# EAGLE design PiezoAmp (EAGLE 5.11)
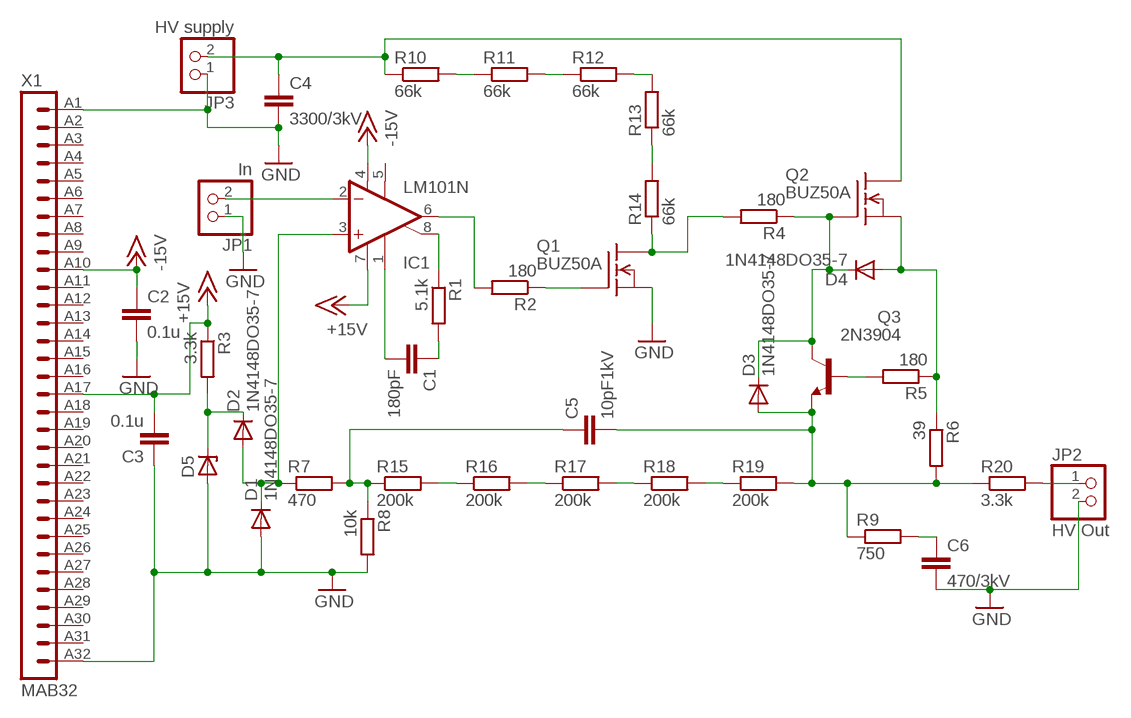
[diagram p0: schematic, sheet 1]

## Parts
C1  180pF  C-EU050-030X075  [C050-030X075]
C2  0.1u  C-EU050-030X075  [C050-030X075]
C3  0.1u  C-EU050-030X075  [C050-030X075]
C4  3300/3kV  C-EU075-032X103  [C075-032X103]
C5  10pF1kV  C-EU075-032X103  [C075-032X103]
C6  470/3kV  C-EU075-032X103  [C075-032X103]
D1  1N4148DO35-7  [DO35-7]
D2  1N4148DO35-7  [DO35-7]
D3  1N4148DO35-7  [DO35-7]
D4  1N4148DO35-7  [DO35-7]
D5  ZENER-DIODEDO34-7  [DO34Z7]
IC1  LM101N  [DIL08]
JP1  In  PINHD-1X2  [1X02]
JP2  HV Out  PINHD-1X2  [1X02]
JP3  HV supply  PINHD-1X2  [1X02]
Q1  BUZ50A  [TO220]
Q2  BUZ50A  [TO220]
Q3  2N3904  [TO92]
R1  5.1k  R-EU_0204/7  [0204/7]
R2  180  R-EU_0204/7  [0204/7]
R3  3.3k  R-EU_0204/7  [0204/7]
R4  180  R-EU_0204/7  [0204/7]
R5  180  R-EU_0204/7  [0204/7]
R6  39  R-EU_0204/7  [0204/7]
R7  470  R-EU_0204/7  [0204/7]
R8  10k  R-EU_0204/7  [0204/7]
R9  750  R-EU_0204/7  [0204/7]
R10  66k  R-EU_0411/15  [0411/15]
R11  66k  R-EU_0411/15  [0411/15]
R12  66k  R-EU_0411/15  [0411/15]
R13  66k  R-EU_0411/15  [0411/15]
R14  66k  R-EU_0411/15  [0411/15]
R15  200k  R-EU_0411/15  [0411/15]
R16  200k  R-EU_0411/15  [0411/15]
R17  200k  R-EU_0411/15  [0411/15]
R18  200k  R-EU_0411/15  [0411/15]
R19  200k  R-EU_0411/15  [0411/15]
R20  3.3k  R-EU_0204/7  [0204/7]
X1  MAB32  [MAB32]

## Nets
+15V: C3.2 IC1.7(V+) R3.1 X1.A17
-15V: C2.1 IC1.4(V-) X1.A10
GND: C2.2 C3.1 C4.2 C6.2 D1.A D5.A JP1.1 JP2.2 JP3.1 Q1.3(S) R8.2 X1.A1 X1.A32
N$1: IC1.2(-IN) JP1.2
N$2: R10.2 R11.1
N$3: R11.2 R12.1
N$4: R12.2 R13.2
N$5: R13.1 R14.2
N$6: Q1.2(D) R4.2 R14.1
N$7: IC1.8(ON2) R1.1
N$8: IC1.6(OUT) R2.2
N$9: Q1.1(G) R2.1
N$11: D3.C D4.C Q2.1(G) Q3.1(C) R4.1
N$12: D4.A Q2.3(S) R5.1 R6.1
N$13: C4.1 JP3.2 Q2.2(D) R10.1
N$14: Q3.2(B) R5.2
N$15: C5.2 D3.A Q3.3(E) R6.2 R9.1 R19.2 R20.1
N$16: R18.2 R19.1
N$17: R17.2 R18.1
N$18: R16.2 R17.1
N$19: R15.2 R16.1
N$20: C5.1 R7.2 R8.1 R15.1
N$21: D1.C D2.A IC1.3(+IN) R7.1
N$23: D2.C D5.C R3.2
N$25: JP2.1 R20.2
N$26: C1.1 R1.2
N$27: C1.2 IC1.1(ON1)
N$28: C6.1 R9.2
Unconnected: IC1.5(OPT) X1.A2 X1.A3 X1.A4 X1.A5 X1.A6 X1.A7 X1.A8 X1.A9 X1.A11 X1.A12 X1.A13 X1.A14 X1.A15 X1.A16 X1.A18 X1.A19 X1.A20 X1.A21 X1.A22 X1.A23 X1.A24 X1.A25 X1.A26 X1.A27 X1.A28 X1.A29 X1.A30 X1.A31

## Library data of the parts
C1-C6 = rcl:C-EU: CAPACITOR, European symbol
D1-D4 = diode:1N4148: DIODE high speed (Philips)
D5 = diode:ZENER-DIODE: Z-Diode
IC1 = linear:LM101: OP AMP
JP1-JP3 = pinhead:PINHD-1X2: PIN HEADER
Q1 Q2 = transistor-fet:BUZ50A: N-Channel Enhancement MOSFET 1000V; 2,5A; 5,0Ohm
Q3 = transistor-npn:2N3904: NPN Transistor
R1-R20 = rcl:R-EU_: RESISTOR, European symbol
X1 = con-vg:MAB32: CONNECTOR male, 32 pins, type B, row A, grid 2.54 mm

## Board
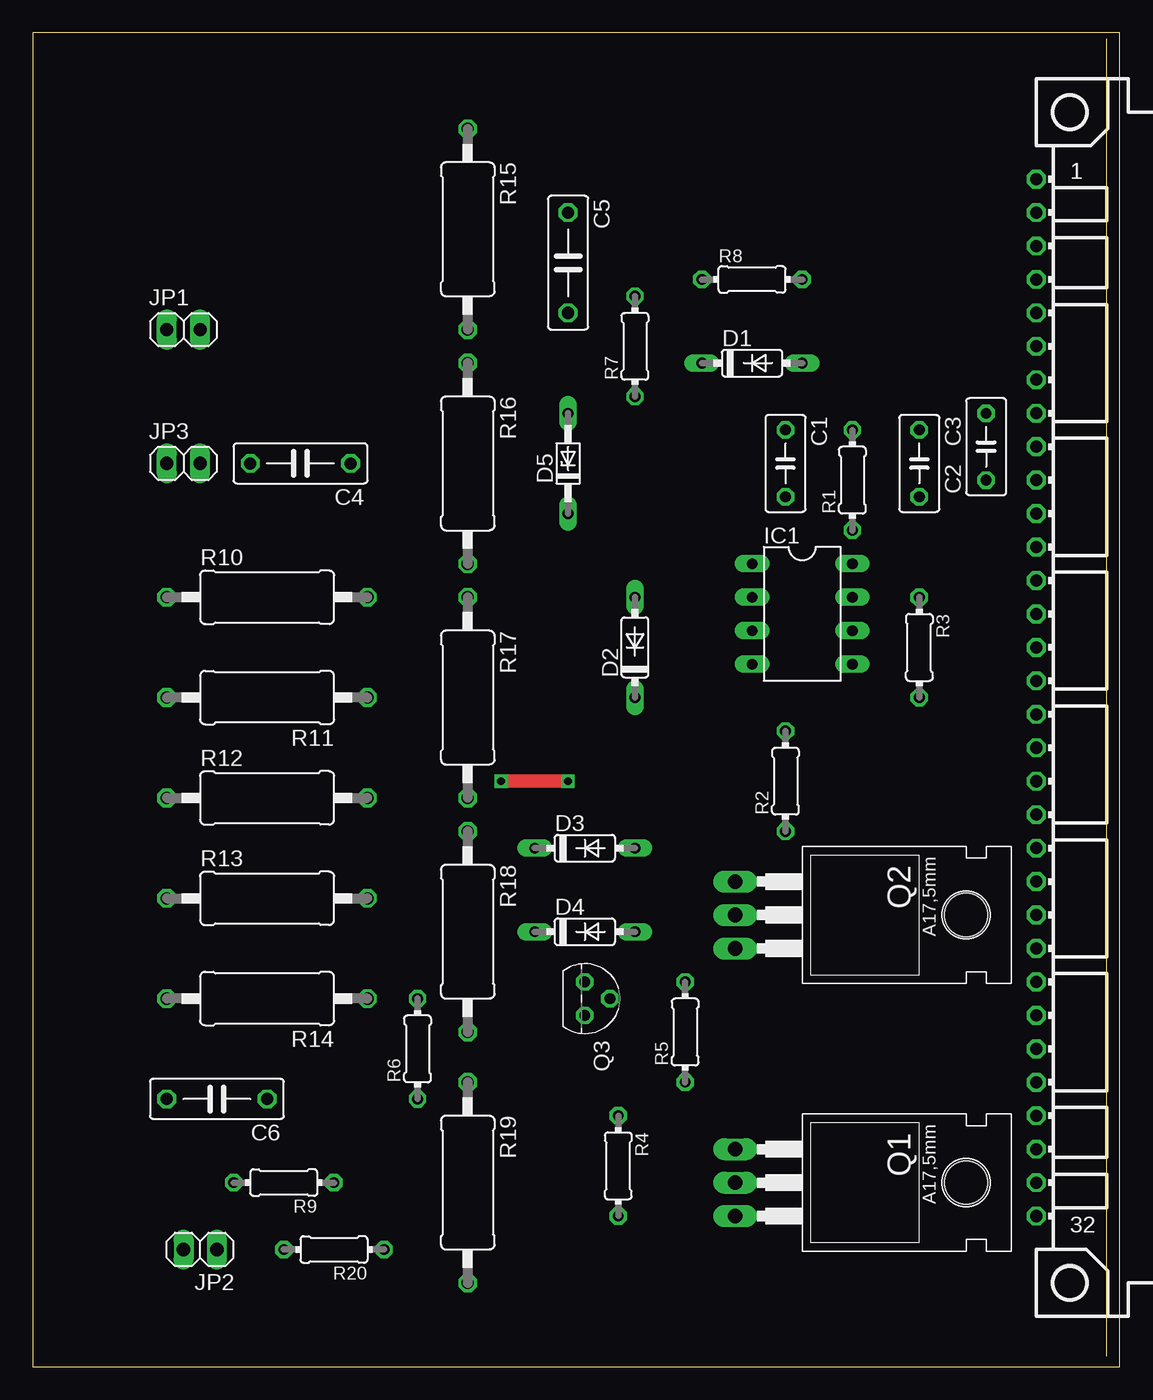
[diagram p1: board, top side]
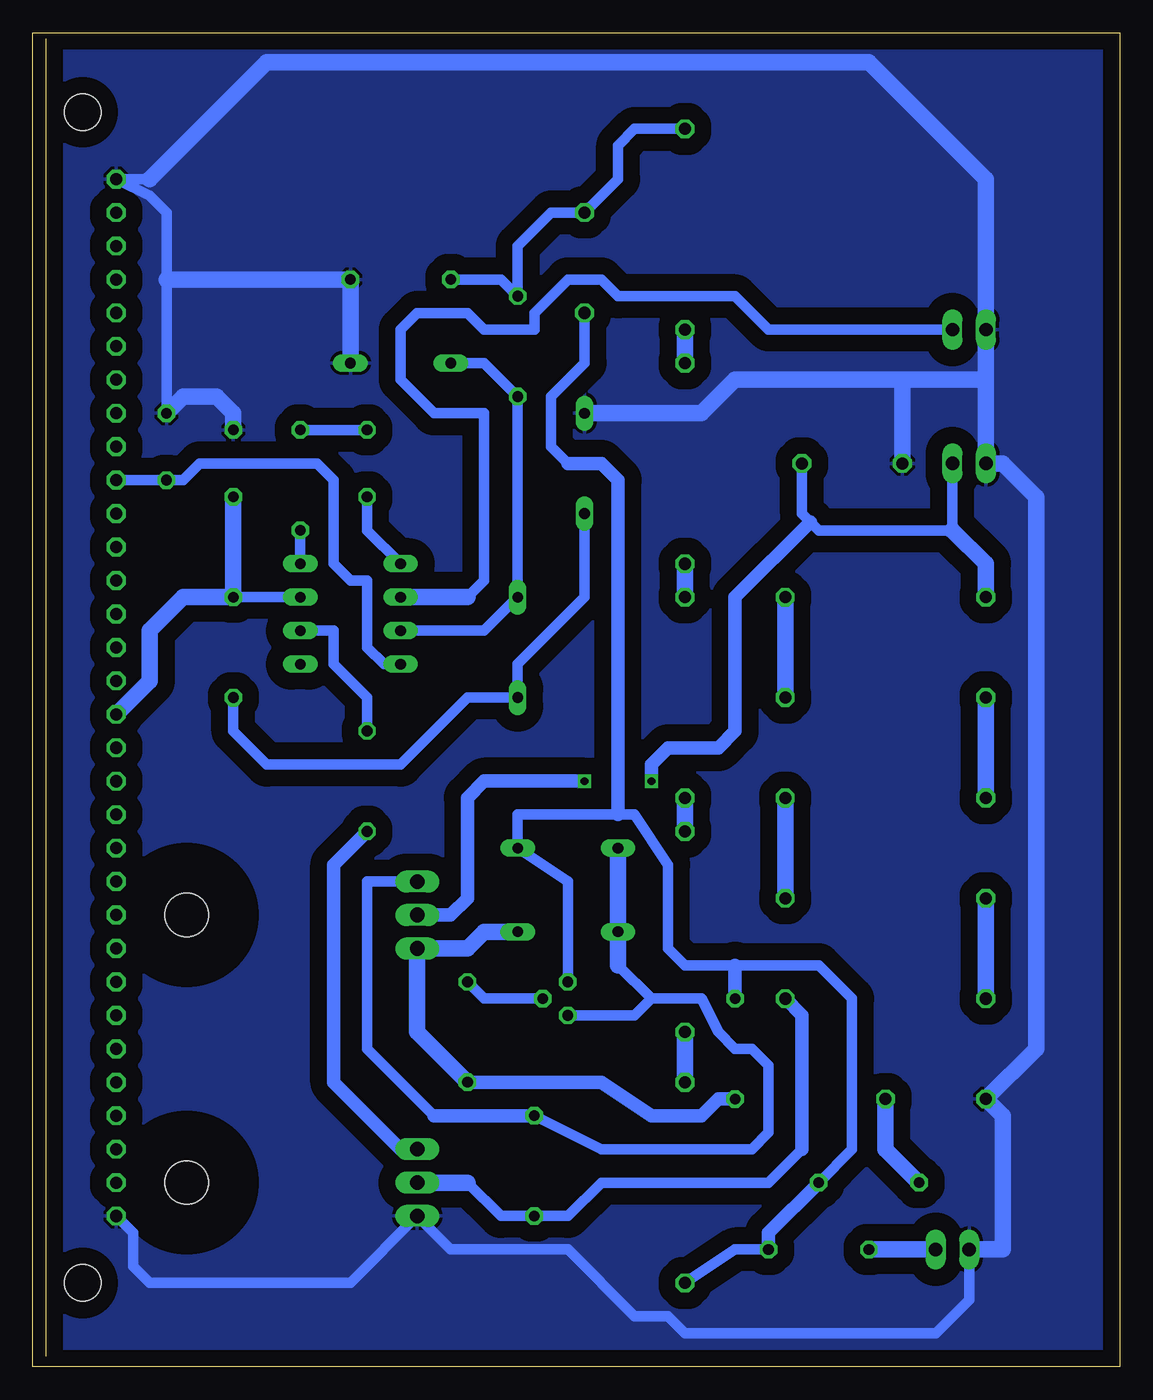
[diagram p2: board, bottom side, seen from below]

Size 82.53 x 101.27 mm. Coordinates in mm from the lower left corner, seen from the top.
Outline: 0,0 82.53,0 82.53,101.27 0,101.27 0,0
Copper layers (1*16): Top 0.035mm / dielectric 1.5mm / Bottom 0.035mm
Design rules "default": minimum track width 10mil, minimum drill 24mil, track to track 8mil, track to pad 8mil, pad to pad 8mil, via to via 8mil, smd to smd 8mil, copper to edge 40mil, drill to drill 8mil, minimum pad ring 10mil, minimum via ring 8mil, stop-mask expansion 4mil, vias tented up to drill 0mil, thermal gap 10mil

### Footprints (pad centres in the part's own frame; a part is rotated, then mirrored left to right if it is on the bottom)
C050-030X075 = drill 0.813 octagon: 1 -2.54,0; 2 2.54,0
C075-032X103 = drill 0.914 octagon: 1 -3.81,0; 2 3.81,0
DO35-7 = drill 0.813 long: A 3.81,0; C -3.81,0
DO34Z7 = drill 0.813 long: A 3.81,0; C -3.81,0
DIL08 = drill 0.813 long: 1 -3.81,-3.81; 2 -1.27,-3.81; 3 1.27,-3.81; 4 3.81,-3.81; 5 3.81,3.81; 6 1.27,3.81; 7 -1.27,3.81; 8 -3.81,3.81
1X02 = drill 1.016 long: 1 -1.27,0; 2 1.27,0
TO220 = drill 1.118 long: 1 -2.54,-6.35; 2 0,-6.35; 3 2.54,-6.35 | hole 3.302: 0,11.176
TO92 = drill 0.813 octagon: 1 1.27,0; 2 0,1.905; 3 -1.27,0
0204/7 = drill 0.813 octagon: 1 -3.81,0; 2 3.81,0
0411/15 = drill 0.914 octagon: 1 -7.62,0; 2 7.62,0
MAB32 = drill 0.914 octagon: A1 -2.54,39.37; A2 -2.54,36.83; A3 -2.54,34.29; A4 -2.54,31.75; A5 -2.54,29.21; A6 -2.54,26.67; A7 -2.54,24.13; A8 -2.54,21.59; A9 -2.54,19.05; A10 -2.54,16.51; A11 -2.54,13.97; A12 -2.54,11.43; A13 -2.54,8.89; A14 -2.54,6.35; A15 -2.54,3.81; A16 -2.54,1.27; A17 -2.54,-1.27; A18 -2.54,-3.81; A19 -2.54,-6.35; A20 -2.54,-8.89; A21 -2.54,-11.43; A22 -2.54,-13.97; A23 -2.54,-16.51; A24 -2.54,-19.05; A25 -2.54,-21.59; A26 -2.54,-24.13; A27 -2.54,-26.67; A28 -2.54,-29.21; A29 -2.54,-31.75; A30 -2.54,-34.29; A31 -2.54,-36.83; A32 -2.54,-39.37 | hole 2.794: 0,44.45; 0,-44.45

### Placement (x,y rotation side)
C1  57.15,68.58 270 top
C2  72.39,69.85 90 top
C3  67.31,68.58 270 top
C4  20.32,68.58 180 top
C5  40.64,83.82 270 top
C6  13.97,20.32 180 top
D1  54.61,76.2 0 top
D2  45.72,54.61 90 top
D3  41.91,39.37 0 top
D4  41.91,33.02 0 top
D5  40.64,68.58 90 top
IC1  58.42,57.15 270 top
JP1  11.43,78.74 0 top
JP2  12.7,8.89 180 top
JP3  11.43,68.58 0 top
Q1  59.69,13.97 270 top
Q2  59.69,34.29 270 top
Q3  41.91,27.94 270 top
R1  62.23,67.31 90 top
R2  57.15,44.45 90 top
R3  67.31,54.61 270 top
R4  44.45,15.24 270 top
R5  49.53,25.4 90 top
R6  29.21,24.13 90 top
R7  45.72,77.47 90 top
R8  54.61,82.55 0 top
R9  19.05,13.97 180 top
R10  17.78,58.42 0 top
R11  17.78,50.8 180 top
R12  17.78,43.18 0 top
R13  17.78,35.56 0 top
R14  17.78,27.94 180 top
R15  33.02,86.36 270 top
R16  33.02,68.58 270 top
R17  33.02,50.8 270 top
R18  33.02,33.02 270 top
R19  33.02,13.97 270 top
R20  22.86,8.89 180 top
X1  78.74,50.8 0 top

### Tracks (layer width: path | path; a pad name or v marks a point on that pad's centre or on a via)
+15V
  Bottom 0.813: IC1.7 R3.1
  Bottom 1.27: X1.A17 73.66,52.07 73.66,55.88 71.12,58.42 R3.1 C3.2
-15V
  Bottom 0.813: IC1.4 55.88,53.34 57.15,54.61 57.15,59.69 58.42,59.69 59.69,60.96 59.69,67.31 60.96,68.58 69.85,68.58 71.12,67.31 C2.1 X1.A10
GND
  Bottom 0.813: C2.2 72.39,82.55 72.39,87.63 73.66,88.9 X1.A1 73.66,90.17 | JP2.2 11.43,5.08 13.97,2.54 33.02,2.54 34.29,3.81 36.83,3.81 41.91,8.89 50.8,8.89 Q1.3 58.42,6.35 73.66,6.35 74.93,7.62 74.93,10.16 X1.A32
  Bottom 1.27: JP2.2 8.89,8.89 8.89,19.05 C6.2 6.35,24.13 6.35,66.04 8.89,68.58 JP3.1 10.16,74.93 | D1.A R8.2 72.39,82.55 | 73.66,90.17 64.77,99.06 19.05,99.06 10.16,90.17 JP1.1 10.16,74.93 | D5.A 31.75,72.39 29.21,74.93 16.51,74.93 | 10.16,74.93 16.51,74.93 | 16.51,74.93 C4.2 | C3.1 67.31,72.39 68.58,73.66 71.12,73.66 C2.2
  pour Bottom (isolate 1.27): 82.55,101.6 0,101.6 0,0 82.55,0
N$1
  Bottom 0.813: 49.53,58.42 48.26,59.69 48.26,72.39 52.07,72.39 54.61,74.93 54.61,78.74 53.34,80.01 49.53,80.01 48.26,78.74 44.45,78.74 44.45,80.01 41.91,82.55 39.37,82.55 38.1,81.28 29.21,81.28 26.67,78.74 JP1.2
  Bottom 1.27: 49.53,58.42 IC1.2
N$2
  Bottom 1.27: R11.1 R10.2
N$3
  Bottom 1.27: R12.1 R11.2
N$4
  Bottom 1.27: R13.2 R12.2
N$5
  Bottom 1.27: R14.2 R13.1
N$6
  Bottom 0.813: 24.13,16.51 26.67,13.97 39.37,13.97 41.91,11.43 R4.2 46.99,11.43 49.53,13.97
  Bottom 1.016: R14.1 24.13,26.67 24.13,16.51
  Bottom 1.27: 49.53,13.97 Q1.2
N$7
  Bottom 0.813: IC1.8 R1.1
N$8
  Bottom 0.813: IC1.6 59.69,55.88 59.69,53.34 57.15,50.8 R2.2
N$9
  Bottom 1.016: R2.1 59.69,38.1 59.69,21.59 54.61,16.51 Q1.1
N$11
  Bottom 0.813: Q2.1 57.15,36.83 57.15,24.13 52.07,19.05 | 35.56,27.94 31.75,27.94 30.48,25.4 29.21,24.13 27.94,24.13 26.67,22.86 26.67,17.78 27.94,16.51 39.37,16.51 R4.1 | 35.56,27.94 38.1,30.48 | Q3.1 36.83,26.67 35.56,27.94
  Bottom 1.016: R4.1 52.07,19.05
  Bottom 1.27: 38.1,30.48 D4.C D3.C
N$12
  Bottom 1.016: R6.1 30.48,20.32 31.75,19.05 35.56,19.05 39.37,21.59 R5.1
  Bottom 1.27: R5.1 53.34,25.4 Q2.3 49.53,31.75 48.26,33.02 D4.A
N$13  (via drill 0.6)
  Top 1.016: v35.56,44.45 v40.64,44.45
  Bottom 0.813: JP3.2 12.7,63.5 22.86,63.5 23.5,64.14 24.13,64.77 C4.1
  Bottom 1.016: Q2.2 50.8,34.29 49.53,35.56 49.53,43.18 48.26,44.45 v40.64,44.45 | v35.56,44.45 35.56,45.72 34.29,46.99 30.48,46.99 29.21,48.26 29.21,58.42 23.5,64.14
  Bottom 1.27: 12.7,63.5 10.16,60.96 R10.1
N$14
  Bottom 0.813: R5.2 48.26,27.94 Q3.2
N$15
  Bottom 0.813: 41.91,68.58 43.18,69.85 43.18,73.66 40.64,76.2 C5.2 | R20.1 29.21,8.89 R19.2 | Q3.3 41.91,36.83 D3.A 45.72,41.91 38.1,41.91 36.83,41.91 34.29,38.1 34.29,31.75 33.02,30.48 29.21,30.48 22.86,30.48 20.32,27.94 20.32,16.51 R9.1
  Bottom 1.016: R9.1 26.67,10.16 R20.1 | 29.21,30.48 R6.2 | 41.91,68.58 39.37,68.58 38.1,67.31 38.1,41.91
N$16
  Bottom 1.27: R19.1 R18.2
N$17
  Bottom 1.27: R18.1 R17.2
N$18
  Bottom 1.27: R17.1 R16.2
N$19
  Bottom 1.27: R16.1 R15.2
N$20
  Bottom 0.813: R8.1 46.99,82.55 R7.2 45.72,85.09 43.18,87.63 C5.1 38.1,90.17 38.1,92.71 36.83,93.98 R15.1
N$21
  Bottom 0.813: IC1.3 48.26,55.88 D2.A R7.1 48.26,76.2 D1.C
N$23
  Bottom 0.813: R3.2 67.31,48.26 64.77,45.72 54.61,45.72 49.53,50.8 D2.C 45.72,53.34 40.64,58.42 D5.C
N$25
  Bottom 1.27: JP2.1 R20.2
N$26
  Bottom 0.813: C1.1 R1.2
N$27
  Bottom 0.813: C1.2 57.15,63.5 IC1.1
N$28
  Bottom 1.27: R9.2 17.78,16.51 C6.1